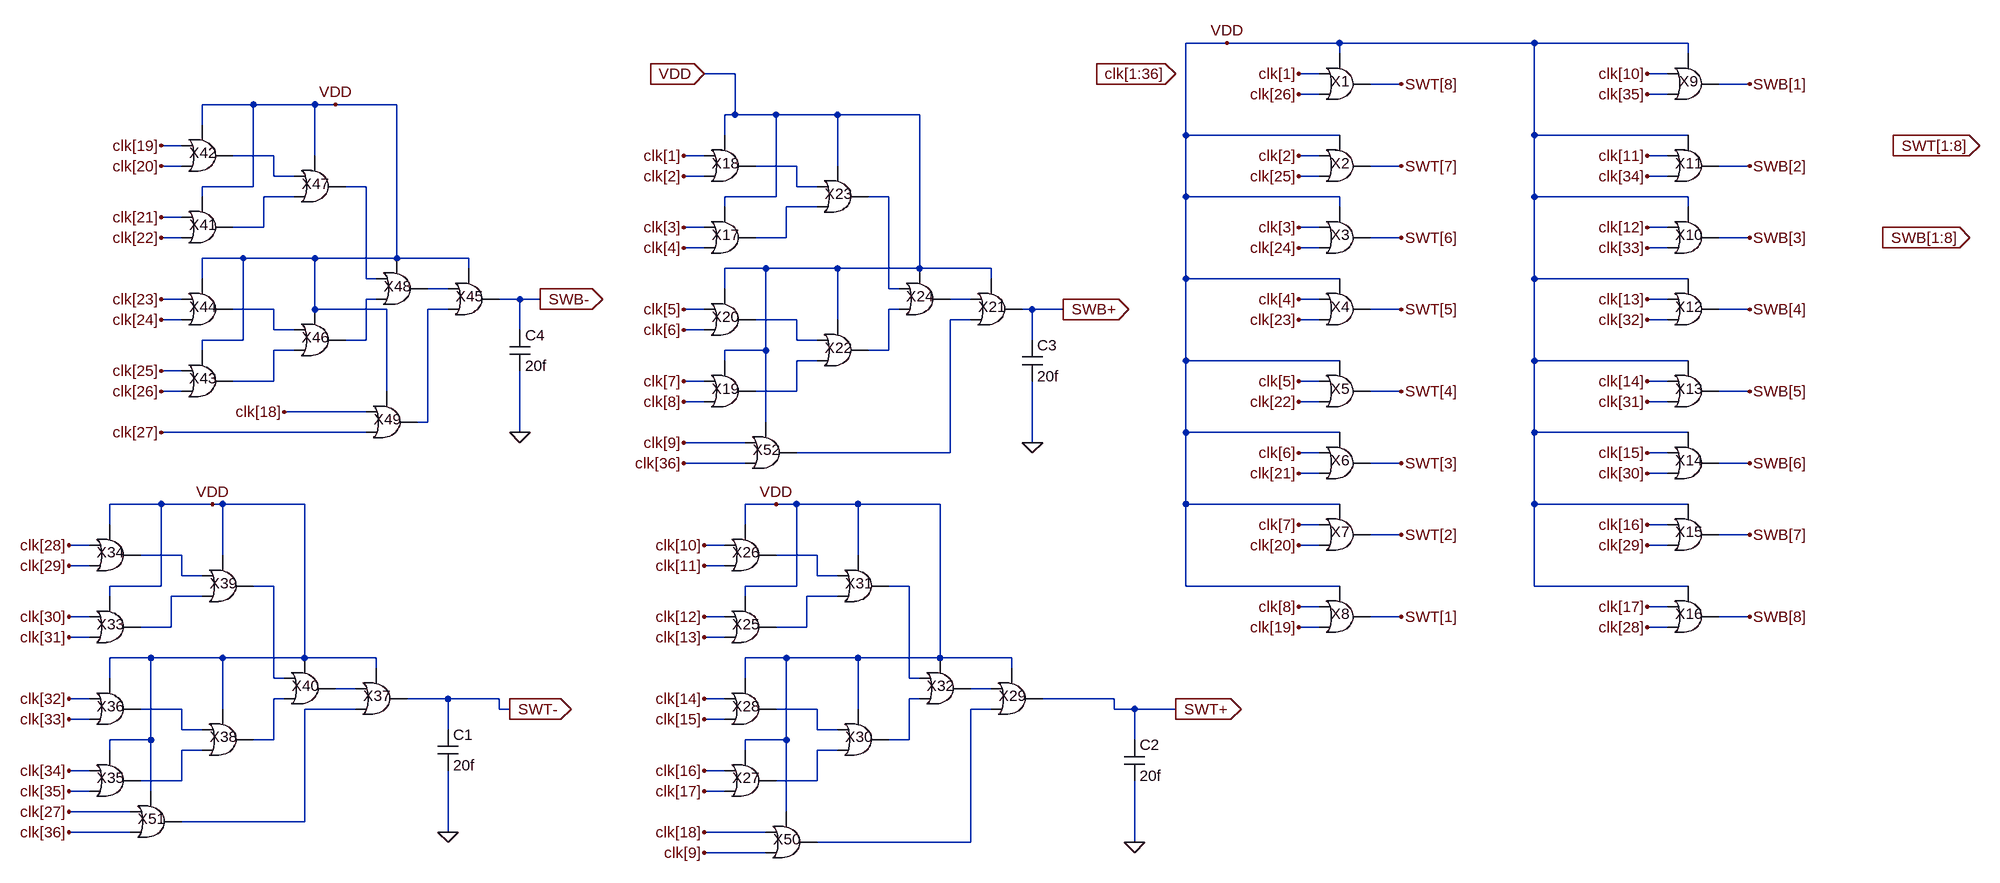
[diagram p0: schematic contRatioCont.asc]
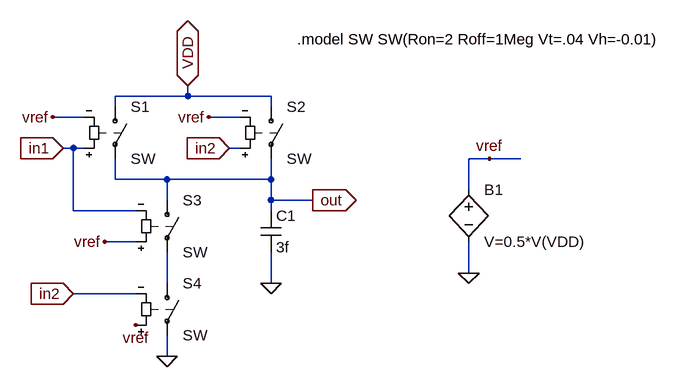
[diagram p1: sub-circuit or2.asc]
contRatioCont.asc, the LTspice schematic file:
Version 4
SHEET 1 1188 1292
WIRE -32 -32 -96 -32
WIRE 144 -32 -32 -32
WIRE 448 -32 144 -32
WIRE 688 -32 448 -32
WIRE 144 -16 144 -32
WIRE 688 -16 688 -32
WIRE -800 16 -848 16
WIRE 112 16 80 16
WIRE 656 16 624 16
WIRE 240 32 192 32
WIRE 784 32 736 32
WIRE 112 48 80 48
WIRE 656 48 624 48
WIRE -1552 64 -1632 64
WIRE -1456 64 -1552 64
WIRE -1424 64 -1456 64
WIRE -1328 64 -1424 64
WIRE -800 80 -800 16
WIRE -800 80 -816 80
WIRE -736 80 -800 80
WIRE -640 80 -736 80
WIRE -512 80 -640 80
WIRE -1632 96 -1632 64
WIRE -816 112 -816 80
WIRE -96 112 -96 -32
WIRE 144 112 -96 112
WIRE 448 112 448 -32
WIRE 688 112 448 112
WIRE -1664 128 -1696 128
WIRE -1520 144 -1584 144
WIRE -1456 144 -1456 64
WIRE -848 144 -880 144
WIRE 112 144 80 144
WIRE 656 144 624 144
WIRE -1664 160 -1696 160
WIRE -704 160 -768 160
WIRE -640 160 -640 80
WIRE 240 160 192 160
WIRE 784 160 736 160
WIRE -1520 176 -1520 144
WIRE -1488 176 -1520 176
WIRE -848 176 -880 176
WIRE 112 176 80 176
WIRE 656 176 624 176
WIRE -1552 192 -1552 64
WIRE -1552 192 -1632 192
WIRE -1376 192 -1408 192
WIRE -704 192 -704 160
WIRE -672 192 -704 192
WIRE -1632 208 -1632 192
WIRE -1488 208 -1536 208
WIRE -736 208 -736 80
WIRE -736 208 -816 208
WIRE -560 208 -592 208
WIRE -96 208 -96 112
WIRE 144 208 -96 208
WIRE 448 208 448 112
WIRE 688 208 448 208
WIRE -816 224 -816 208
WIRE -672 224 -720 224
WIRE 144 224 144 208
WIRE 688 224 688 208
WIRE -1664 240 -1696 240
WIRE -1536 256 -1536 208
WIRE -1536 256 -1584 256
WIRE -848 256 -880 256
WIRE 112 256 80 256
WIRE 656 256 624 256
WIRE -1664 272 -1696 272
WIRE -720 272 -720 224
WIRE -720 272 -768 272
WIRE 240 272 192 272
WIRE 784 272 736 272
WIRE -848 288 -880 288
WIRE 112 288 80 288
WIRE 656 288 624 288
WIRE -1568 304 -1632 304
WIRE -1456 304 -1568 304
WIRE -1328 304 -1328 64
WIRE -1328 304 -1456 304
WIRE -1216 304 -1328 304
WIRE -1216 320 -1216 304
WIRE -752 320 -816 320
WIRE -640 320 -752 320
WIRE -512 320 -512 80
WIRE -512 320 -640 320
WIRE -400 320 -512 320
WIRE -1632 336 -1632 304
WIRE -1376 336 -1376 192
WIRE -1360 336 -1376 336
WIRE -400 336 -400 320
WIRE -96 336 -96 208
WIRE 144 336 -96 336
WIRE 448 336 448 208
WIRE 688 336 448 336
WIRE -1248 352 -1280 352
WIRE -816 352 -816 320
WIRE -560 352 -560 208
WIRE -544 352 -560 352
WIRE -1664 368 -1696 368
WIRE -1360 368 -1376 368
WIRE -1136 368 -1168 368
WIRE -1104 368 -1136 368
WIRE -432 368 -464 368
WIRE 112 368 80 368
WIRE 656 368 624 368
WIRE -1520 384 -1584 384
WIRE -1456 384 -1456 304
WIRE -1344 384 -1456 384
WIRE -1248 384 -1280 384
WIRE -848 384 -880 384
WIRE -544 384 -560 384
WIRE -336 384 -352 384
WIRE -288 384 -336 384
WIRE 240 384 192 384
WIRE 784 384 736 384
WIRE -1664 400 -1696 400
WIRE -704 400 -768 400
WIRE -640 400 -640 320
WIRE -432 400 -464 400
WIRE 112 400 80 400
WIRE 656 400 624 400
WIRE -1520 416 -1520 384
WIRE -1488 416 -1520 416
WIRE -1136 416 -1136 368
WIRE -848 416 -880 416
WIRE -1568 432 -1568 304
WIRE -1568 432 -1632 432
WIRE -1376 432 -1376 368
WIRE -1376 432 -1408 432
WIRE -704 432 -704 400
WIRE -672 432 -704 432
WIRE -336 432 -336 384
WIRE -1632 448 -1632 432
WIRE -1488 448 -1520 448
WIRE -752 448 -752 320
WIRE -752 448 -816 448
WIRE -560 448 -560 384
WIRE -560 448 -592 448
WIRE -816 464 -816 448
WIRE -672 464 -704 464
WIRE -96 464 -96 336
WIRE 144 464 -96 464
WIRE 448 464 448 336
WIRE 688 464 448 464
WIRE -1664 480 -1696 480
WIRE -1520 496 -1520 448
WIRE -1520 496 -1584 496
WIRE -848 496 -880 496
WIRE 112 496 80 496
WIRE 656 496 624 496
WIRE -1664 512 -1696 512
WIRE -1344 512 -1344 384
WIRE -704 512 -704 464
WIRE -704 512 -768 512
WIRE 240 512 192 512
WIRE 784 512 736 512
WIRE -848 528 -880 528
WIRE 112 528 80 528
WIRE 656 528 624 528
WIRE -1376 544 -1504 544
WIRE -1280 560 -1280 384
WIRE -1280 560 -1296 560
WIRE -752 560 -752 448
WIRE -1376 576 -1696 576
WIRE -1136 576 -1136 480
WIRE -96 576 -96 464
WIRE 144 576 -96 576
WIRE 448 576 448 464
WIRE 688 576 448 576
WIRE -784 592 -880 592
WIRE -336 592 -336 496
WIRE -464 608 -464 400
WIRE -464 608 -704 608
WIRE 112 608 80 608
WIRE 656 608 624 608
WIRE -784 624 -880 624
WIRE 240 624 192 624
WIRE 784 624 736 624
WIRE 112 640 80 640
WIRE 656 640 624 640
WIRE -1696 688 -1776 688
WIRE -1616 688 -1696 688
WIRE -1600 688 -1616 688
WIRE -1472 688 -1600 688
WIRE -736 688 -784 688
WIRE -704 688 -736 688
WIRE -608 688 -704 688
WIRE -480 688 -608 688
WIRE -96 688 -96 576
WIRE 144 688 -96 688
WIRE 448 688 448 576
WIRE 688 688 448 688
WIRE -1776 720 -1776 688
WIRE -784 720 -784 688
WIRE 112 720 80 720
WIRE 656 720 624 720
WIRE 240 736 192 736
WIRE 784 736 736 736
WIRE -1808 752 -1840 752
WIRE -816 752 -848 752
WIRE 112 752 80 752
WIRE 656 752 624 752
WIRE -1664 768 -1728 768
WIRE -1600 768 -1600 688
WIRE -672 768 -736 768
WIRE -608 768 -608 688
WIRE -1808 784 -1840 784
WIRE -816 784 -848 784
WIRE -1664 800 -1664 768
WIRE -1632 800 -1664 800
WIRE -672 800 -672 768
WIRE -640 800 -672 800
WIRE -1696 816 -1696 688
WIRE -1696 816 -1776 816
WIRE -1520 816 -1552 816
WIRE -704 816 -704 688
WIRE -704 816 -784 816
WIRE -528 816 -560 816
WIRE -96 816 -96 688
WIRE 144 816 -96 816
WIRE 448 816 448 688
WIRE 688 816 448 816
WIRE -1776 832 -1776 816
WIRE -1632 832 -1680 832
WIRE -784 832 -784 816
WIRE -640 832 -688 832
WIRE 112 848 80 848
WIRE 656 848 624 848
WIRE -1808 864 -1840 864
WIRE -816 864 -848 864
WIRE 240 864 192 864
WIRE 784 864 736 864
WIRE -1680 880 -1680 832
WIRE -1680 880 -1728 880
WIRE -688 880 -688 832
WIRE -688 880 -736 880
WIRE 112 880 80 880
WIRE 656 880 624 880
WIRE -1808 896 -1840 896
WIRE -816 896 -848 896
WIRE -1712 928 -1776 928
WIRE -1600 928 -1712 928
WIRE -1472 928 -1472 688
WIRE -1472 928 -1600 928
WIRE -1360 928 -1472 928
WIRE -720 928 -784 928
WIRE -608 928 -720 928
WIRE -480 928 -480 688
WIRE -480 928 -608 928
WIRE -368 928 -480 928
WIRE -1360 944 -1360 928
WIRE -368 944 -368 928
WIRE -1776 960 -1776 928
WIRE -1520 960 -1520 816
WIRE -1504 960 -1520 960
WIRE -784 960 -784 928
WIRE -528 960 -528 816
WIRE -512 960 -528 960
WIRE -1392 976 -1424 976
WIRE -400 976 -432 976
WIRE -1808 992 -1840 992
WIRE -1504 992 -1520 992
WIRE -1248 992 -1312 992
WIRE -1168 992 -1248 992
WIRE -816 992 -848 992
WIRE -512 992 -528 992
WIRE -208 992 -320 992
WIRE -1664 1008 -1728 1008
WIRE -1600 1008 -1600 928
WIRE -1392 1008 -1472 1008
WIRE -1168 1008 -1168 992
WIRE -1152 1008 -1168 1008
WIRE -672 1008 -736 1008
WIRE -608 1008 -608 928
WIRE -400 1008 -432 1008
WIRE -208 1008 -208 992
WIRE -176 1008 -208 1008
WIRE -112 1008 -176 1008
WIRE -1808 1024 -1840 1024
WIRE -816 1024 -848 1024
WIRE -1664 1040 -1664 1008
WIRE -1632 1040 -1664 1040
WIRE -1248 1040 -1248 992
WIRE -672 1040 -672 1008
WIRE -640 1040 -672 1040
WIRE -1712 1056 -1712 928
WIRE -1712 1056 -1776 1056
WIRE -1520 1056 -1520 992
WIRE -1520 1056 -1552 1056
WIRE -720 1056 -720 928
WIRE -720 1056 -784 1056
WIRE -528 1056 -528 992
WIRE -528 1056 -560 1056
WIRE -176 1056 -176 1008
WIRE -1776 1072 -1776 1056
WIRE -1632 1072 -1664 1072
WIRE -784 1072 -784 1056
WIRE -640 1072 -672 1072
WIRE -1808 1104 -1840 1104
WIRE -816 1104 -848 1104
WIRE -1664 1120 -1664 1072
WIRE -1664 1120 -1728 1120
WIRE -672 1120 -672 1072
WIRE -672 1120 -736 1120
WIRE -1808 1136 -1840 1136
WIRE -1712 1136 -1712 1056
WIRE -816 1136 -848 1136
WIRE -1744 1168 -1840 1168
WIRE -720 1168 -720 1056
WIRE -1472 1184 -1472 1008
WIRE -1472 1184 -1664 1184
WIRE -1744 1200 -1840 1200
WIRE -1248 1200 -1248 1104
WIRE -752 1200 -848 1200
WIRE -432 1216 -432 1008
WIRE -432 1216 -672 1216
WIRE -176 1216 -176 1120
WIRE -752 1232 -848 1232
FLAG -112 16 clk[1:36]
IOPIN -112 16 In
FLAG 80 16 clk[1]
FLAG 240 32 SWT[8]
FLAG 80 48 clk[26]
FLAG 80 144 clk[2]
FLAG 80 176 clk[25]
FLAG 80 256 clk[3]
FLAG 80 288 clk[24]
FLAG 80 368 clk[4]
FLAG 80 400 clk[23]
FLAG 80 496 clk[5]
FLAG 80 528 clk[22]
FLAG 80 608 clk[6]
FLAG 80 640 clk[21]
FLAG 80 720 clk[7]
FLAG 80 752 clk[20]
FLAG 80 848 clk[8]
FLAG 80 880 clk[19]
FLAG 240 160 SWT[7]
FLAG 240 272 SWT[6]
FLAG 240 384 SWT[5]
FLAG 240 512 SWT[4]
FLAG 240 624 SWT[3]
FLAG 240 736 SWT[2]
FLAG 240 864 SWT[1]
FLAG 624 16 clk[10]
FLAG 784 32 SWB[1]
FLAG 624 48 clk[35]
FLAG 624 144 clk[11]
FLAG 624 176 clk[34]
FLAG 624 256 clk[12]
FLAG 624 288 clk[33]
FLAG 624 368 clk[13]
FLAG 624 400 clk[32]
FLAG 624 496 clk[14]
FLAG 624 528 clk[31]
FLAG 624 608 clk[15]
FLAG 624 640 clk[30]
FLAG 624 720 clk[16]
FLAG 624 752 clk[29]
FLAG 624 848 clk[17]
FLAG 624 880 clk[28]
FLAG 784 160 SWB[2]
FLAG 784 272 SWB[3]
FLAG 784 384 SWB[4]
FLAG 784 512 SWB[5]
FLAG 784 624 SWB[6]
FLAG 784 736 SWB[7]
FLAG 784 864 SWB[8]
FLAG -880 144 clk[1]
FLAG -880 176 clk[2]
FLAG -880 256 clk[3]
FLAG -880 288 clk[4]
FLAG -880 384 clk[5]
FLAG -880 416 clk[6]
FLAG -880 496 clk[7]
FLAG -880 528 clk[8]
FLAG -880 592 clk[9]
FLAG -848 16 VDD
IOPIN -848 16 In
FLAG -32 -32 VDD
FLAG -288 384 SWB+
IOPIN -288 384 Out
FLAG -848 752 clk[10]
FLAG -848 784 clk[11]
FLAG -848 864 clk[12]
FLAG -848 896 clk[13]
FLAG -848 992 clk[14]
FLAG -848 1024 clk[15]
FLAG -848 1104 clk[16]
FLAG -848 1136 clk[17]
FLAG -848 1200 clk[18]
FLAG -112 1008 SWT+
IOPIN -112 1008 Out
FLAG -1840 752 clk[28]
FLAG -1840 784 clk[29]
FLAG -1840 864 clk[30]
FLAG -1840 896 clk[31]
FLAG -1840 992 clk[32]
FLAG -1840 1024 clk[33]
FLAG -1840 1104 clk[34]
FLAG -1840 1136 clk[35]
FLAG -1840 1200 clk[36]
FLAG -1152 1008 SWT-
IOPIN -1152 1008 Out
FLAG -1696 128 clk[19]
FLAG -1696 160 clk[20]
FLAG -1696 240 clk[21]
FLAG -1696 272 clk[22]
FLAG -1696 368 clk[23]
FLAG -1696 400 clk[24]
FLAG -1696 480 clk[25]
FLAG -1696 512 clk[26]
FLAG -1696 576 clk[27]
FLAG -1104 368 SWB-
IOPIN -1104 368 Out
FLAG -736 688 VDD
FLAG -1616 688 VDD
FLAG 1008 128 SWT[1:8]
IOPIN 1008 128 Out
FLAG 992 272 SWB[1:8]
IOPIN 992 272 Out
FLAG -1424 64 VDD
FLAG -1504 544 clk[18]
FLAG -848 1232 clk[9]
FLAG -1840 1168 clk[27]
FLAG -880 624 clk[36]
FLAG -1248 1200 0
FLAG -176 1216 0
FLAG -336 592 0
FLAG -1136 576 0
SYMBOL or2 192 32 R0
SYMATTR InstName X1
SYMBOL or2 192 272 R0
SYMATTR InstName X3
SYMBOL or2 192 160 R0
SYMATTR InstName X2
SYMBOL or2 192 384 R0
SYMATTR InstName X4
SYMBOL or2 192 512 R0
SYMATTR InstName X5
SYMBOL or2 192 624 R0
SYMATTR InstName X6
SYMBOL or2 192 736 R0
SYMATTR InstName X7
SYMBOL or2 192 864 R0
SYMATTR InstName X8
SYMBOL or2 736 32 R0
SYMATTR InstName X9
SYMBOL or2 736 272 R0
SYMATTR InstName X10
SYMBOL or2 736 160 R0
SYMATTR InstName X11
SYMBOL or2 736 384 R0
SYMATTR InstName X12
SYMBOL or2 736 512 R0
SYMATTR InstName X13
SYMBOL or2 736 624 R0
SYMATTR InstName X14
SYMBOL or2 736 736 R0
SYMATTR InstName X15
SYMBOL or2 736 864 R0
SYMATTR InstName X16
SYMBOL or2 -768 272 R0
SYMATTR InstName X17
SYMBOL or2 -768 160 R0
SYMATTR InstName X18
SYMBOL or2 -768 512 R0
SYMATTR InstName X19
SYMBOL or2 -768 400 R0
SYMATTR InstName X20
SYMBOL or2 -352 384 R0
SYMATTR InstName X21
SYMBOL or2 -592 448 R0
SYMATTR InstName X22
SYMBOL or2 -592 208 R0
SYMATTR InstName X23
SYMBOL or2 -464 368 R0
SYMATTR InstName X24
SYMBOL or2 -736 880 R0
SYMATTR InstName X25
SYMBOL or2 -736 768 R0
SYMATTR InstName X26
SYMBOL or2 -736 1120 R0
SYMATTR InstName X27
SYMBOL or2 -736 1008 R0
SYMATTR InstName X28
SYMBOL or2 -320 992 R0
SYMATTR InstName X29
SYMBOL or2 -560 1056 R0
SYMATTR InstName X30
SYMBOL or2 -560 816 R0
SYMATTR InstName X31
SYMBOL or2 -432 976 R0
SYMATTR InstName X32
SYMBOL or2 -1728 880 R0
SYMATTR InstName X33
SYMBOL or2 -1728 768 R0
SYMATTR InstName X34
SYMBOL or2 -1728 1120 R0
SYMATTR InstName X35
SYMBOL or2 -1728 1008 R0
SYMATTR InstName X36
SYMBOL or2 -1312 992 R0
SYMATTR InstName X37
SYMBOL or2 -1552 1056 R0
SYMATTR InstName X38
SYMBOL or2 -1552 816 R0
SYMATTR InstName X39
SYMBOL or2 -1424 976 R0
SYMATTR InstName X40
SYMBOL or2 -1584 256 R0
SYMATTR InstName X41
SYMBOL or2 -1584 144 R0
SYMATTR InstName X42
SYMBOL or2 -1584 496 R0
SYMATTR InstName X43
SYMBOL or2 -1584 384 R0
SYMATTR InstName X44
SYMBOL or2 -1168 368 R0
SYMATTR InstName X45
SYMBOL or2 -1408 432 R0
SYMATTR InstName X46
SYMBOL or2 -1408 192 R0
SYMATTR InstName X47
SYMBOL or2 -1280 352 R0
SYMATTR InstName X48
SYMBOL or2 -1296 560 R0
SYMATTR InstName X49
SYMBOL or2 -672 1216 R0
SYMATTR InstName X50
SYMBOL or2 -1664 1184 R0
SYMATTR InstName X51
SYMBOL or2 -704 608 R0
SYMATTR InstName X52
SYMBOL cap -1264 1040 R0
SYMATTR InstName C1
SYMATTR Value 20f
SYMBOL cap -192 1056 R0
SYMATTR InstName C2
SYMATTR Value 20f
SYMBOL cap -352 432 R0
SYMATTR InstName C3
SYMATTR Value 20f
SYMBOL cap -1152 416 R0
SYMATTR InstName C4
SYMATTR Value 20f

or2.asc, the sub-circuit schematic file:
Version 4
SHEET 1 1084 680
WIRE 256 64 256 48
WIRE 256 64 144 64
WIRE 384 64 256 64
WIRE 144 80 144 64
WIRE 384 80 384 64
WIRE 96 96 48 96
WIRE 336 96 288 96
WIRE 80 144 64 144
WIRE 96 144 80 144
WIRE 336 144 320 144
WIRE 720 160 688 160
WIRE 768 160 720 160
WIRE 144 192 144 160
WIRE 224 192 144 192
WIRE 384 192 384 160
WIRE 384 192 224 192
WIRE 688 208 688 160
WIRE 224 224 224 192
WIRE 384 224 384 192
WIRE 448 224 384 224
WIRE 80 240 80 144
WIRE 176 240 80 240
WIRE 384 240 384 224
WIRE 176 288 128 288
WIRE 688 336 688 288
WIRE 224 352 224 304
WIRE 384 352 384 304
WIRE 176 368 80 368
WIRE 224 464 224 432
FLAG 224 464 0
FLAG 64 144 in1
IOPIN 64 144 In
FLAG 80 368 in2
IOPIN 80 368 In
FLAG 320 144 in2
IOPIN 320 144 In
FLAG 256 48 VDD
IOPIN 256 48 BiDir
FLAG 448 224 out
IOPIN 448 224 Out
FLAG 720 160 vref
FLAG 688 336 0
FLAG 176 416 vref
FLAG 128 288 vref
FLAG 48 96 vref
FLAG 288 96 vref
FLAG 384 352 0
SYMBOL sw 144 64 R0
SYMATTR InstName S1
SYMBOL sw 384 64 R0
SYMATTR InstName S2
SYMBOL sw 224 208 R0
SYMATTR InstName S3
SYMBOL sw 224 336 R0
SYMATTR InstName S4
SYMBOL bv 688 192 R0
SYMATTR InstName B1
SYMATTR Value V=0.5*V(VDD)
SYMBOL cap 368 240 R0
SYMATTR InstName C1
SYMATTR Value 3f
TEXT 424 -24 Left 2 !.model SW SW(Ron=2 Roff=1Meg Vt=.04 Vh=-0.01)

The netlist it stands for:
* contRatioCont.asc
XX1 clk[1] clk[26] SWT[8] VDD or2
XX3 clk[3] clk[24] SWT[6] VDD or2
XX2 clk[2] clk[25] SWT[7] VDD or2
XX4 clk[4] clk[23] SWT[5] VDD or2
XX5 clk[5] clk[22] SWT[4] VDD or2
XX6 clk[6] clk[21] SWT[3] VDD or2
XX7 clk[7] clk[20] SWT[2] VDD or2
XX8 clk[8] clk[19] SWT[1] VDD or2
XX9 clk[10] clk[35] SWB[1] VDD or2
XX10 clk[12] clk[33] SWB[3] VDD or2
XX11 clk[11] clk[34] SWB[2] VDD or2
XX12 clk[13] clk[32] SWB[4] VDD or2
XX13 clk[14] clk[31] SWB[5] VDD or2
XX14 clk[15] clk[30] SWB[6] VDD or2
XX15 clk[16] clk[29] SWB[7] VDD or2
XX16 clk[17] clk[28] SWB[8] VDD or2
XX17 clk[3] clk[4] N006 VDD or2
XX18 clk[1] clk[2] N002 VDD or2
XX19 clk[7] clk[8] N016 VDD or2
XX20 clk[5] clk[6] N013 VDD or2
XX21 N009 N014 SWB+ VDD or2
XX22 N013 N016 N012 VDD or2
XX23 N002 N006 N005 VDD or2
XX24 N005 N012 N009 VDD or2
XX25 clk[12] clk[13] N022 VDD or2
XX26 clk[10] clk[11] N018 VDD or2
XX27 clk[16] clk[17] N032 VDD or2
XX28 clk[14] clk[15] N029 VDD or2
XX29 N024 N030 SWT+ VDD or2
XX30 N029 N032 N026 VDD or2
XX31 N018 N022 N020 VDD or2
XX32 N020 N026 N024 VDD or2
XX33 clk[30] clk[31] N021 VDD or2
XX34 clk[28] clk[29] N017 VDD or2
XX35 clk[34] clk[35] N031 VDD or2
XX36 clk[32] clk[33] N027 VDD or2
XX37 N023 N028 SWT- VDD or2
XX38 N027 N031 N025 VDD or2
XX39 N017 N021 N019 VDD or2
XX40 N019 N025 N023 VDD or2
XX41 clk[21] clk[22] N004 VDD or2
XX42 clk[19] clk[20] N001 VDD or2
XX43 clk[25] clk[26] N015 VDD or2
XX44 clk[23] clk[24] N010 VDD or2
XX45 N007 N011 SWB- VDD or2
XX46 N010 N015 N008 VDD or2
XX47 N001 N004 N003 VDD or2
XX48 N003 N008 N007 VDD or2
XX49 clk[18] clk[27] N011 VDD or2
XX50 clk[18] clk[9] N030 VDD or2
XX51 clk[27] clk[36] N028 VDD or2
XX52 clk[9] clk[36] N014 VDD or2
C1 SWT- 0 20f
C2 SWT+ 0 20f
C3 SWB+ 0 20f
C4 SWB- 0 20f

* block symbol definitions
.subckt or2 in1 in2 out VDD
S1 VDD out in1 vref SW
S2 VDD out in2 vref SW
S3 out N001 vref in1 SW
S4 N001 0 vref in2 SW
B1 vref 0 V=0.5*V(VDD)
C1 out 0 3f
.model SW SW(Ron=2 Roff=1Meg Vt=.04 Vh=-0.01)
.ends or2

.backanno
.end